# Altium schematic sheet [16] PCB_Mech.SchDoc: PCB marking & mechanical parts
size A4; Engineer: M. Folejewski; DocumentNumber: 16; SheetNumber: 16; SheetTotal: 17; PageSize: A4; Designators: 950-999
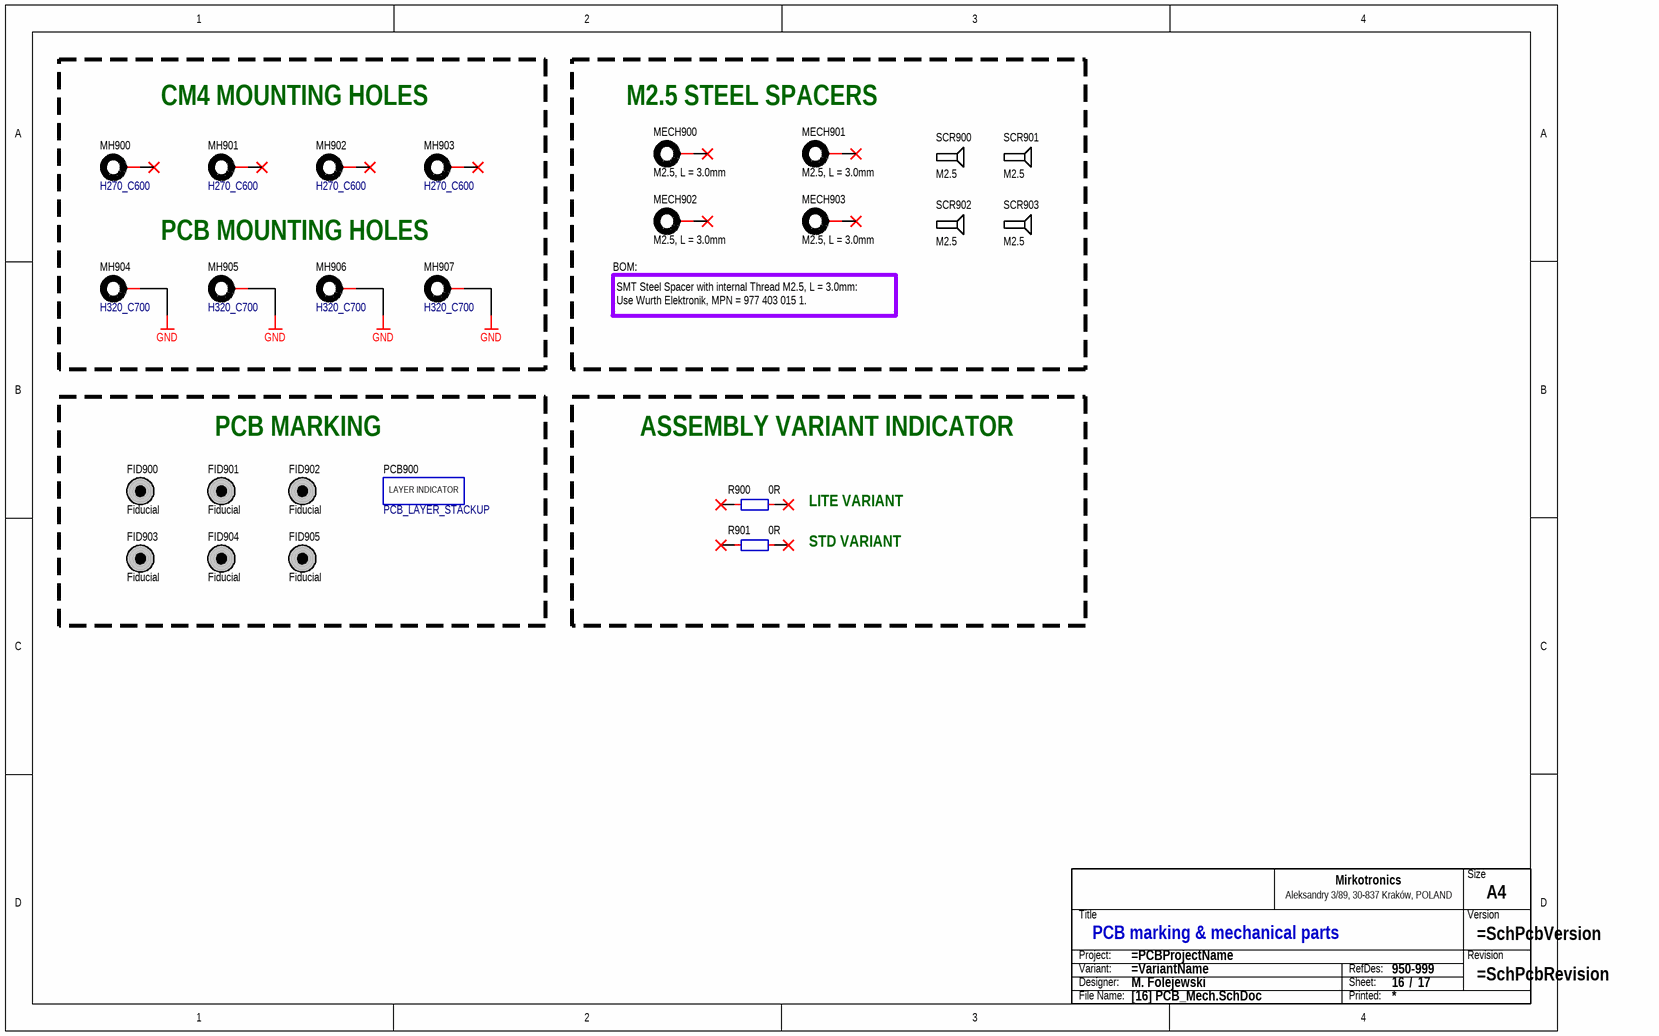
[diagram p0: [16] PCB_Mech.SchDoc]

## Parts
FID900  Fiducial  [PCB_FID_RND_100x300]  (no BOM)
FID901  Fiducial  [PCB_FID_RND_100x300]  (no BOM)
FID902  Fiducial  [PCB_FID_RND_100x300]  (no BOM)
FID903  Fiducial  [PCB_FID_RND_100x300]  (no BOM)
FID904  Fiducial  [PCB_FID_RND_100x300]  (no BOM)
FID905  Fiducial  [PCB_FID_RND_100x300]  (no BOM)
MECH900  M2.5, L = 3.0mm  [PCB_WRT_9774030151]
MECH901  M2.5, L = 3.0mm  [PCB_WRT_9774030151]
MECH902  M2.5, L = 3.0mm  [PCB_WRT_9774030151]
MECH903  M2.5, L = 3.0mm  [PCB_WRT_9774030151]
MH900  H270_C600  [PCB_MH_H270_C600]  (no BOM)
MH901  H270_C600  [PCB_MH_H270_C600]  (no BOM)
MH902  H270_C600  [PCB_MH_H270_C600]  (no BOM)
MH903  H270_C600  [PCB_MH_H270_C600]  (no BOM)
MH904  H320_C700  [PCB_MH_H320_C700]  (no BOM)
MH905  H320_C700  [PCB_MH_H320_C700]  (no BOM)
MH906  H320_C700  [PCB_MH_H320_C700]  (no BOM)
MH907  H320_C700  [PCB_MH_H320_C700]  (no BOM)
PCB900  PCB_LAYER_STACKUP  [PCB_STACKUP-4L]  (no BOM)
R900  0R  [RES_0805_R]
R901  0R  [RES_0805_R]
SCR900  M2.5  (mechanical)
SCR901  M2.5  (mechanical)
SCR902  M2.5  (mechanical)
SCR903  M2.5  (mechanical)
TB?  Title block  (value not drawn)  (graphical)

## Nets
GND: MH904.MH MH905.MH MH906.MH MH907.MH

Not connected (* = marked no-connect by the designer): MECH900 1*; MECH901 1*; MECH902 1*; MECH903 1*; MH900 1*; MH901 1*; MH902 1*; MH903 1*; R900 1* 2*; R901 1* 2*

## Notes on the sheet
- CM4 MOUNTING HOLES
- M2.5 STEEL SPACERS
- PCB MOUNTING HOLES
- SMT Steel Spacer with internal Thread M2.5, L = 3.0mm:
  Use Wurth Elektronik, MPN = 977 403 015 1.
- BOM:
- PCB MARKING
- ASSEMBLY VARIANT INDICATOR
- LITE VARIANT
- STD VARIANT
- (in symbol PCB_LAYER_STACKUP) LAYER INDICATOR
- (in symbol SCH_TITLE_BLOCK_MIRKOTRONICS_V2) Size; Mirkotronics; Aleksandry 3/89, 30-837 Kraków, POLAND; Title; Version; Project:; Revision; Variant:; RefDes:; Designer:; Sheet:; /; File Name:; Printed:

## Library data of the parts
FID900-FID905 = PCB_FID_RND: PCB Marking; Fiducial; Round;; Value: Fiducial; Component Subtype: -; Component Type: Fiducial; Mounting Type: -; Supplier: ?
MECH900-MECH903 = PCB_MECH_WRT_WA-SMSI: PCB; Mechanical; SMT Steel Spacer; M2.5;; Manufacturer: Wurth Elektronik; MPN: 977 403 015 1; Component Subtype: SMD Spacer; Package (Case): SMD; Value: M2.5, L = 3.0mm; Component Type: Spacer (Standoff); Mounting Type: SMD; Supplier: Wurth Elektronik; Supplier 1: Wurth Elektronik; Supplier Part Number 1: 977 403 015 1
MH900-MH907 = PCB_MECH_MH: PCB Marking; Mounting hole;; Component Subtype: -; Component Type: Mounting Hole; Mounting Type: -; Supplier: ?
  MH900-MH903: Value: H270_C600
  MH904-MH907: Value: H320_C700
R900 R901 = RES-0047: Resistor; Thick Film; 0R; 1%; TBD; TBD; TBD; Standard; SMD; 0805 (2012);; ID: RES-0047; Component Type: Resistor; Component Subtype: Thick Film; Value: 0R; Manufacturer: TBD; MPN: TBD; Mounting Type: SMD; Package (Case): 0805 (2012); Component Body: TBD; Component Height: TBD; Packaging Type: TBD; ROHS Status: TBD; Operating Temperature: TBD; Resistance: 0R; Tolerance: 1%; Power Rating: TBD; TCR: TBD; Voltage Rating: TBD; Features: Standard; Supplier 1: LCSC; Supplier Part Number 1: C17477
SCR900-SCR903 = PCB_MECH_SCR: Mechnical; Screw;; MPN: M2.5 screw; Manufacturer: *; Value: M2.5
TB? = SCH_TITLE_BLOCK_MIRKOTRONICS_V2: Component Type: Title block; Manufacturer: -; Mounting Type: Non component; MPN: -; Operating Temperature: -; Package: -; Specification: Title block; Value: Title block; Replacement: -; System: ?
PCB900 = PCB_LAYER_STACKUP: Component Subtype: -; Component Type: PCB Marking; Mounting Type: -; Supplier: ?